# EAGLE design Sony PSP USB-C (EAGLE 6.2)
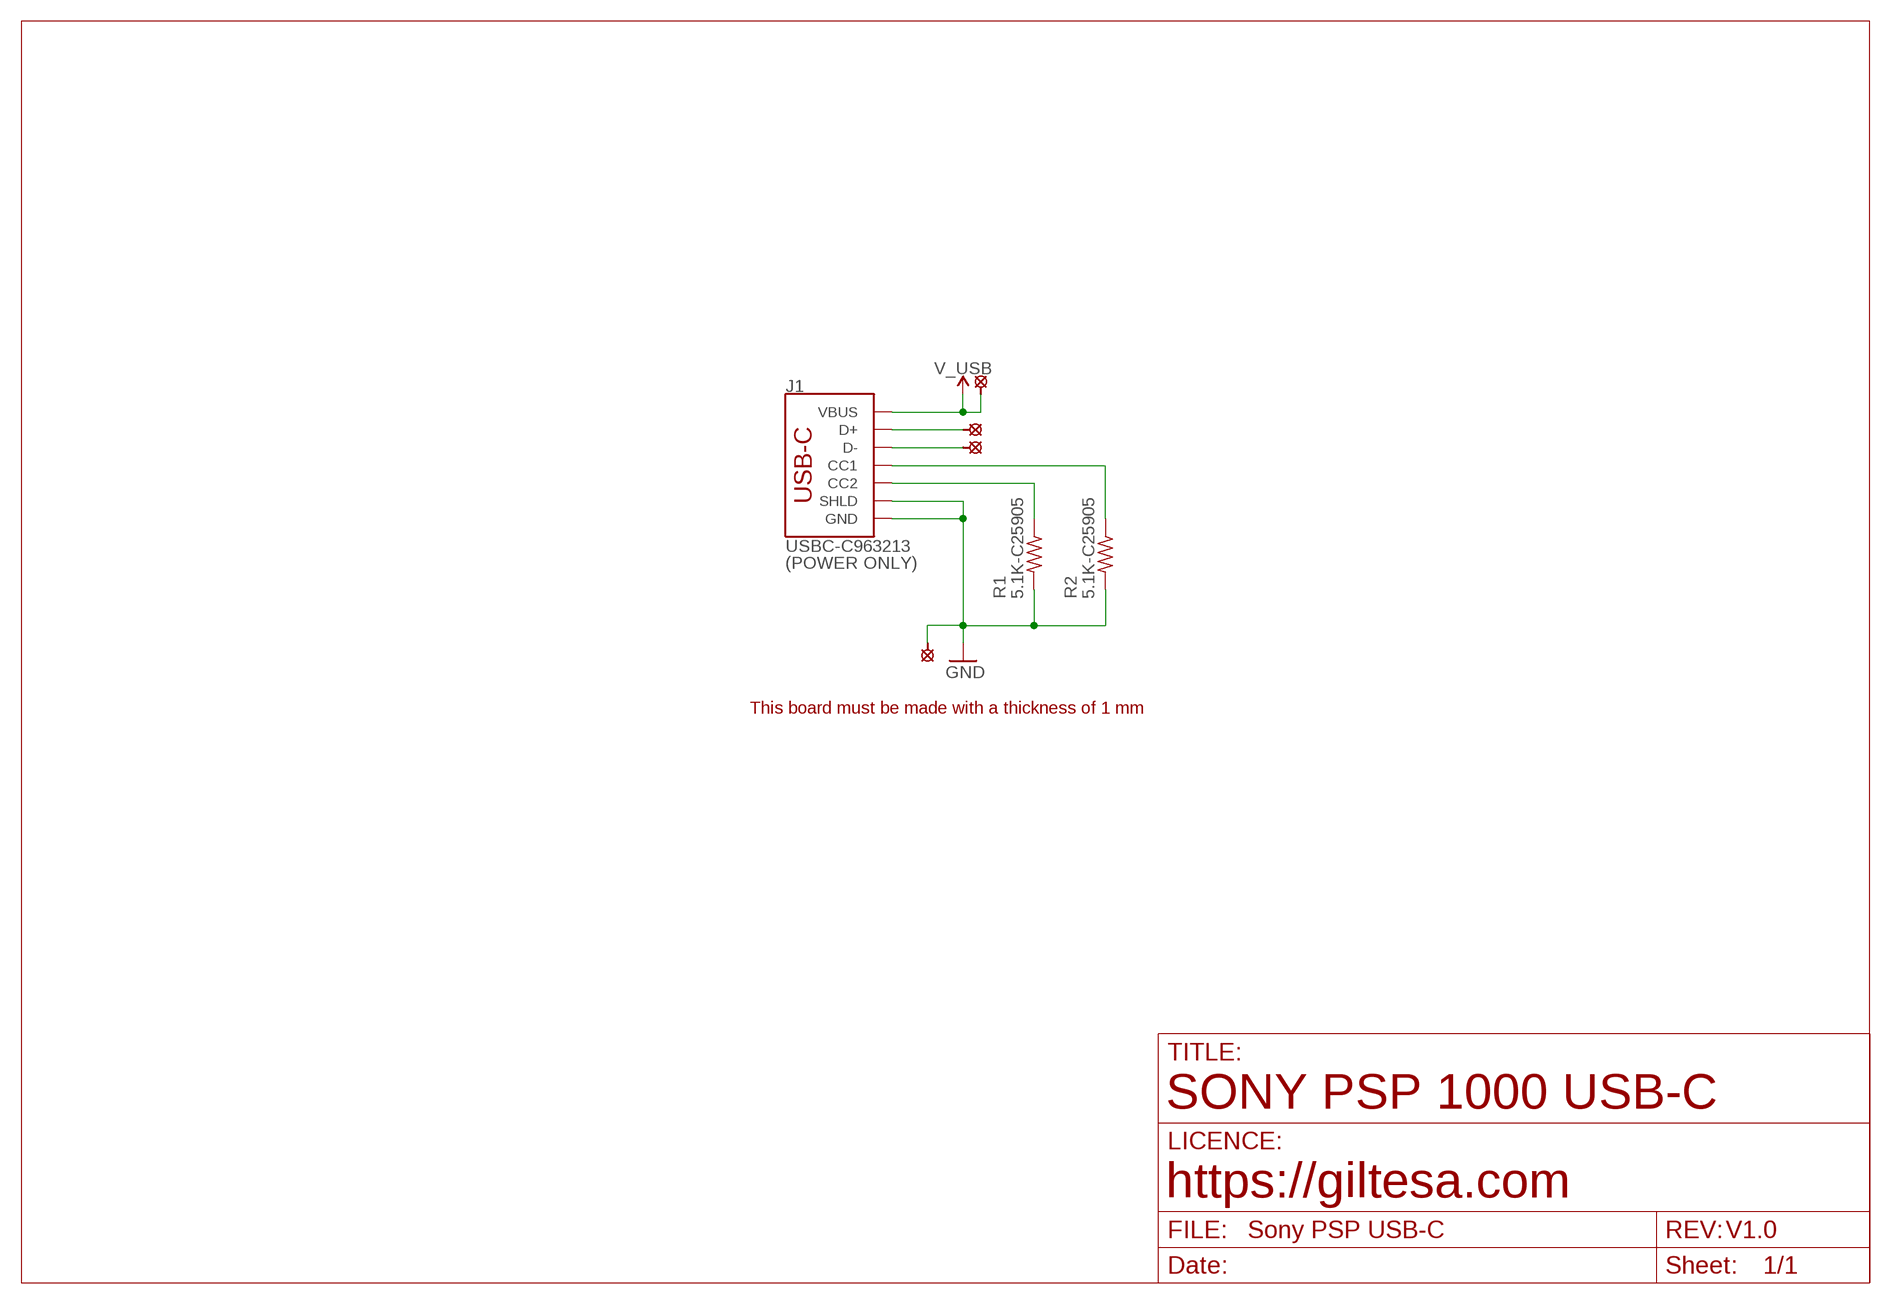
[diagram p0: schematic, sheet 1]

## Parts
J1  USBC-C963213  USB-C_16P_DATA_SLIM  [USB-C_18P_SLIM_GT-USB-7025]
R1  5.1K-C25905  R0402  [R0402]
R2  5.1K-C25905  R0402  [R0402]
U$1  SOLDER_PAD_PSP_1000  [PSP_1000_PAD]
U$3  SOLDER_PAD_PSP_1000  [PSP_1000_PAD]
U$5  SOLDER_PAD-1.3  [SOLDER_PAD_1.3]
U$6  SOLDER_PAD-1.3  [SOLDER_PAD_1.3]

## Nets
CC1: J1.A5-CC1(CC1) R2.1
CC2: J1.B5-CC2(CC2) R1.1
D+: J1.A6-DP1(D+) J1.B6-DP2(D+) U$5.P$1
D-: J1.A7-DN1(D-) J1.B7-DN2(D-) U$6.P$1
GND: J1.A1-GND(GND) J1.A12-GND(GND) J1.B1-GND(GND) J1.B12-GND(GND) J1.GND1(GND) J1.GND2(GND) J1.SHLD1(SHLD) J1.SHLD2(SHLD) J1.SHLD3(SHLD) J1.SHLD4(SHLD) R1.2 R2.2 U$1.1
V_USB: J1.A4-VBUS(VBUS) J1.A9-VBUS(VBUS) J1.B4-VBUS(VBUS) J1.B9-VBUS(VBUS) U$3.1

## Notes on the sheet
- (POWER ONLY)
- This board must be made with a thickness of 1 mm
- SONY PSP 1000 USB-C
- https://giltesa.com
- V1.0

## Library data of the parts
J1 = ,giltesa:USB-C_16P
R1 R2 = ,giltesa:R0402
U$1 U$3 U$5 U$6 = ,giltesa:SOLDER_PAD

## Net classes
1 power: width 0.61 mm, drill 0.406 mm, clearance 0.203 mm
2 gnd: width 0.305 mm, drill 0.406 mm, clearance 0.203 mm
3 power usb: width 0.508 mm, drill 0.406 mm, clearance 0.203 mm

## Board
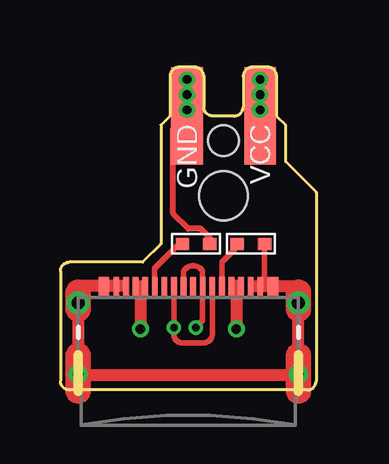
[diagram p1: board, top side]
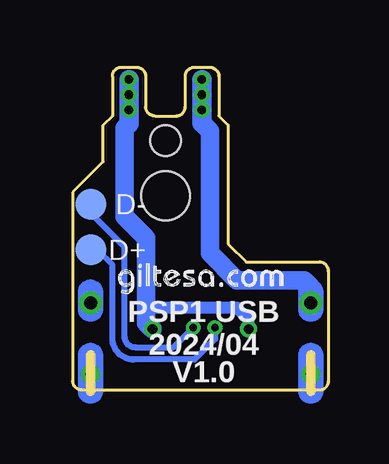
[diagram p2: board, bottom side, seen from below]

Size 10.67 x 13.46 mm. Coordinates in mm from the lower left corner, seen from the top.
Outline: 3.43,5.33 0.38,5.33 arc90 0,4.95 0,0.38 arc90 0.38,0 10.29,0 arc90 10.67,0.38 10.67,8.26 9.4,9.53 9.4,11.05 9.02,11.43 9.02,13.08 arc90 8.64,13.46 8.01,13.46 arc90 7.63,13.08 7.63,11.81 arc-90 7.24,11.43 6.35,11.43 arc-90 5.98,11.81 5.98,13.08 arc90 5.6,13.46 4.96,13.46 arc90 4.57,13.08 4.57,11.43 4.19,11.05 4.19,6.1 3.43,5.33
Copper layers (1*16): Top 0.035mm / dielectric 1.6mm / Bottom 0.035mm
Design rules: minimum track width 6mil, minimum drill 12mil, track to track 6mil, track to pad 6mil, pad to pad 6mil, via to via 8mil, smd to smd 0mil, copper to edge 20mil, drill to drill 10mil, minimum pad ring 6mil, minimum via ring 6mil, stop-mask expansion 0mil, vias tented up to drill 100mil, thermal gap 10mil
Holes 2.03 mm at 6.8,8.1
Holes 1.27 mm at 6.8,10.4

### Footprints (pad centres in the part's own frame; a part is rotated, then mirrored left to right if it is on the bottom)
USB-C_18P_SLIM_GT-USB-7025 = smd 0.24 x 0.8: A1-GND -3,1.845; A4-VBUS -2.2,1.845; A5-CC1 -1.4,1.845; A6-DP1 -0.6,1.845; A7-DN1 -0.2,1.845; A8-SBU1 0.2,1.845; A9-VBUS 1.8,1.845; A12-GND 2.6,1.845; B1-GND 3,1.845; B4-VBUS 2.2,1.845; B5-CC2 1.4,1.845; B6-DP2 1,1.845; B7-DN2 0.6,1.845; B8-SBU2 -1,1.845; B9-VBUS -1.8,1.845; B12-GND -2.6,1.845 | smd 0.45 x 0.8: GND1 -3.525,1.845; GND2 3.525,1.845 | drill 0.55 pad 0.95: SHLD1 -4.595,1.155; SHLD2 4.595,1.155 | drill 0.4 pad 0.8: SHLD3 -4.595,-1.815; SHLD4 4.595,-1.815
R0402 = smd 0.559 x 0.5: 1 -0.567,0; 2 0.567,0
PSP_1000_PAD = smd 1.321 x 4.064: 1 0,0
SOLDER_PAD_1.3 = smd 1.3 x 1.3: P$1 0,0

### Placement (x,y rotation side)
J1  5.33,2.47 0 top
R1  7.95,6.1 0 top
R2  5.66,6.1 0 top
U$1  5.28,11.43 0 top
U$3  8.33,11.43 0 top
U$5  9.91,5.84 0 bottom
U$6  9.91,7.75 0 bottom
U$11  [GILTESA.COM_MASK_7MM]  8.81,3.94 0 bottom

### Tracks (layer width: path | path; a pad name or v marks a point on that pad's centre or on a via)
CC1
  Top 0.229: J1.A5-CC1 3.93,5.08 4.95,6.1 R2.1
CC2
  Top 0.203: J1.B5-CC2 6.73,4.19
  Top 0.229: 6.73,4.19 6.73,4.33 arc-90 6.73,4.33 | J1.B5-CC2 6.73,5.34 7.38,5.98 R1.1
D+  (via drill 0.3)
  Top 0.229: 4.73,4.33 J1.A6-DP1 v4.73,2.6 4.73,2.31 arc90 5.08,1.97 5.97,1.97 arc90 6.33,2.33 J1.B6-DP2 6.33,4.33
  Bottom 0.254: v4.73,2.6 4.73,2.12 5.59,1.27 8.13,1.27 arc90 9.02,2.16 9.02,5.21 9.65,5.84 U$5.P$1
D-  (via drill 0.3)
  Top 0.229: J1.A7-DN1 5.13,4.95 arc-120 5.93,4.95 J1.B7-DN2 5.93,2.9 v5.64,2.6
  Bottom 0.254: v5.64,2.6 6.46,1.78 8.06,1.78 arc90 8.51,2.22 8.51,5.97 9.91,7.37 U$6.P$1
GND  (via drill 0.36)
  Top 0.203: 7.93,4.33 8,4.33 | 8,4.33 8.08,4.33 | 2.73,4.33 2.73,4.35 2.59,4.34 | 2.33,4.33 1.81,4.33 J1.GND1 | 2.33,4.34 2.33,4.33 | J1.B12-GND J1.A1-GND 2.33,4.33 | J1.B1-GND J1.A12-GND 8,4.32 8,4.33 | J1.GND2 8.89,4.32 8.89,4.33
  Top 0.229: R1.2 8.51,4.67 J1.GND2
  Top 0.254: R2.2 6.23,6.35 5.84,6.73 5.33,6.73 4.7,7.37 4.7,10.92 4.95,11.18 4.95,11.1 U$1.1
  Top 0.508: 8.08,4.33 8.89,4.33 9.86,4.33 9.93,4.26 J1.SHLD2 J1.SHLD4 9.93,0.64 1.02,0.64 | 2.59,4.34 2.33,4.34 0.74,4.34 J1.SHLD1 J1.SHLD3 | J1.SHLD3 0.74,0.64 1.02,0.64 | J1.SHLD3 1.02,0.66 1.02,0.64
  Top 0.762: U$1.1 5.02,11.43 5.28,11.05
  Top 0.914: 5.28,11.05 U$1.1 v5.28,12.32
  Bottom 0.762: J1.SHLD1 0.74,4.29 1.02,4.57 3.81,4.57 4.95,5.71 4.95,10.79 5.28,11.12
  Bottom 0.813: 5.28,11.12 v5.28,11.68 v5.28,12.32 v5.28,12.95
N$1
  Top 0.254: 10.17,0.43 9.93,0.67
V_USB  (via drill 0.36, 0.41)
  Top 0.127: 3.33,4.4 3.51,4.49 | J1.B9-VBUS 3.53,4.33
  Top 0.203: 3.53,4.33 3.33,4.33 | 3.13,4.33 3.16,4.33 J1.A4-VBUS 3.17,4.31 | 3.36,4.31 3.17,4.31 | 7.53,4.33 7.34,4.33 7.13,4.33 7.13,4.39 7.23,4.49 7.43,4.49 | J1.B9-VBUS 3.36,4.31 | 3.36,4.31 3.33,4.29 | J1.B9-VBUS J1.A4-VBUS 3.17,4.32 3.17,4.31 | J1.B4-VBUS J1.A9-VBUS 7.34,4.32 7.34,4.19 | 3.19,4.49 3.51,4.49
  Top 0.254: 3.33,4.4 3.33,4.33
  Top 0.508: 3.33,4.29 v3.33,2.54 | 7.34,4.33 7.34,4.19 v7.34,2.54
  Top 0.762: U$3.1 8.58,11.43 8.33,11.05
  Top 0.914: 8.33,11.05 v8.33,12.32
  Bottom 0.508: v3.33,2.54 3.33,2.95 3.81,3.43 7.62,3.43
  Bottom 0.762: v7.34,2.54 7.37,2.54 7.62,2.79 7.62,3.43 7.62,6.35 8.51,7.24 8.51,10.92 8.33,11.1
  Bottom 0.813: 8.33,11.1 v8.33,11.68 v8.33,12.32 v8.33,12.95

### Text on the board
tPlace: GND | VCC
bPlace: D- | D+ | PSP1 USB | 2024/04 | V1.0